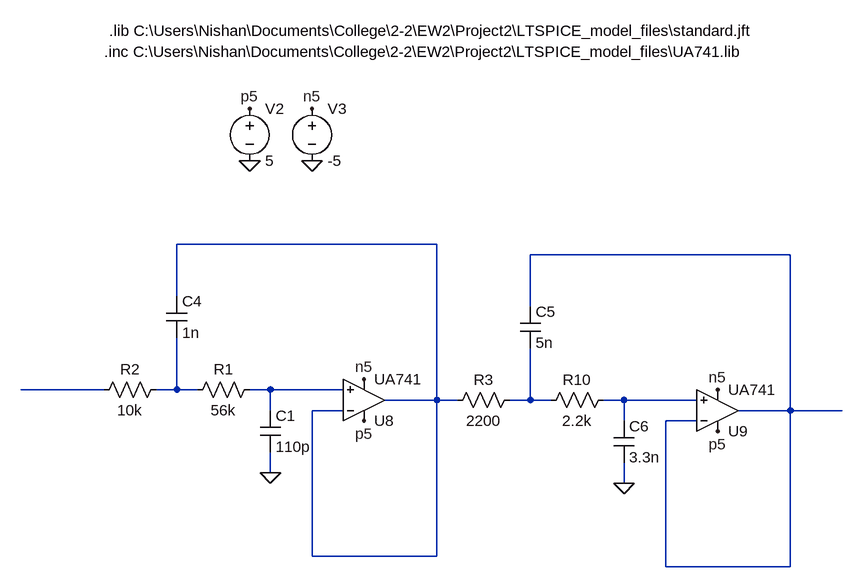
[diagram p0: schematic AAF.asc]
AAF.asc, the LTspice schematic file:
Version 4.1
SHEET 1 4496 2220
WIRE 304 368 -96 368
WIRE 848 384 448 384
WIRE -96 448 -96 368
WIRE 448 464 448 384
WIRE -208 592 -336 592
WIRE -96 592 -96 512
WIRE -96 592 -128 592
WIRE -64 592 -96 592
WIRE 48 592 16 592
WIRE 160 592 48 592
WIRE 304 608 304 368
WIRE 304 608 224 608
WIRE 336 608 304 608
WIRE 448 608 448 528
WIRE 448 608 416 608
WIRE 480 608 448 608
WIRE 592 608 560 608
WIRE 704 608 592 608
WIRE 48 624 48 592
WIRE 160 624 112 624
WIRE 848 624 848 384
WIRE 848 624 768 624
WIRE 928 624 848 624
WIRE 592 640 592 608
WIRE 704 640 656 640
WIRE 48 720 48 688
WIRE 592 736 592 704
WIRE 112 848 112 624
WIRE 304 848 304 608
WIRE 304 848 112 848
WIRE 656 864 656 640
WIRE 848 864 848 624
WIRE 848 864 656 864
FLAG 16 240 0
FLAG 112 240 0
FLAG 16 160 p5
FLAG 112 160 n5
FLAG 592 736 0
FLAG 48 720 0
FLAG 192 576 n5
FLAG 192 640 p5
FLAG 736 592 n5
FLAG 736 656 p5
SYMBOL voltage 16 144 R0
WINDOW 123 0 0 Left 0
WINDOW 39 0 0 Left 0
SYMATTR InstName V2
SYMATTR Value 5
SYMBOL voltage 112 144 R0
WINDOW 123 0 0 Left 0
WINDOW 39 0 0 Left 0
SYMATTR InstName V3
SYMATTR Value -5
SYMBOL cap 32 624 R0
SYMATTR InstName C1
SYMATTR Value 110p
SYMBOL res -80 608 R270
WINDOW 0 32 56 VTop 2
WINDOW 3 0 56 VBottom 2
SYMATTR InstName R1
SYMATTR Value 56k
SYMBOL cap -112 448 R0
SYMATTR InstName C4
SYMATTR Value 1n
SYMBOL res -112 576 R90
WINDOW 0 0 56 VBottom 2
WINDOW 3 32 56 VTop 2
SYMATTR InstName R2
SYMATTR Value 10k
SYMBOL res 432 592 R90
WINDOW 0 0 56 VBottom 2
WINDOW 3 32 56 VTop 2
SYMATTR InstName R3
SYMATTR Value 2200
SYMBOL res 576 592 R90
WINDOW 0 0 56 VBottom 2
WINDOW 3 32 56 VTop 2
SYMATTR InstName R10
SYMATTR Value 2.2k
SYMBOL cap 432 464 R0
SYMATTR InstName C5
SYMATTR Value 5n
SYMBOL cap 576 640 R0
SYMATTR InstName C6
SYMATTR Value 3.3n
SYMBOL OpAmps\\opamp2 192 672 M180
SYMATTR InstName U8
SYMATTR Value UA741
SYMBOL OpAmps\\opamp2 736 688 M180
SYMATTR InstName U9
SYMATTR Value UA741
TEXT -200 40 Left 2 !.lib C:\\Users\\Nishan\\Documents\\College\\2-2\\EW2\\Project2\\LTSPICE_model_files\\standard.jft
TEXT -208 72 Left 2 !.inc C:\\Users\\Nishan\\Documents\\College\\2-2\\EW2\\Project2\\LTSPICE_model_files\\UA741.lib

The netlist it stands for:
* AAF.asc
V2 p5 0 5
V3 n5 0 -5
C1 N005 0 110p
R1 N004 N005 56k
C4 N001 N004 1n
R2 N004 N003 10k
R3 N006 N001 2200
R10 N007 N006 2.2k
C5 N002 N006 5n
C6 N007 0 3.3n
X§U8 N005 N001 p5 n5 N001 UA741  ; pins In+ In- V+ V- OUT
X§U9 N007 N002 p5 n5 N002 UA741  ; pins In+ In- V+ V- OUT
.lib C:\Users\Nishan\Documents\College\2-2\EW2\Project2\LTSPICE_model_files\standard.jft
.inc C:\Users\Nishan\Documents\College\2-2\EW2\Project2\LTSPICE_model_files\UA741.lib
.backanno
.end